# Altium schematic sheet ESP32-HWE-Dev.SchDoc
size A4; SheetNumber: 3; SheetTotal: 4
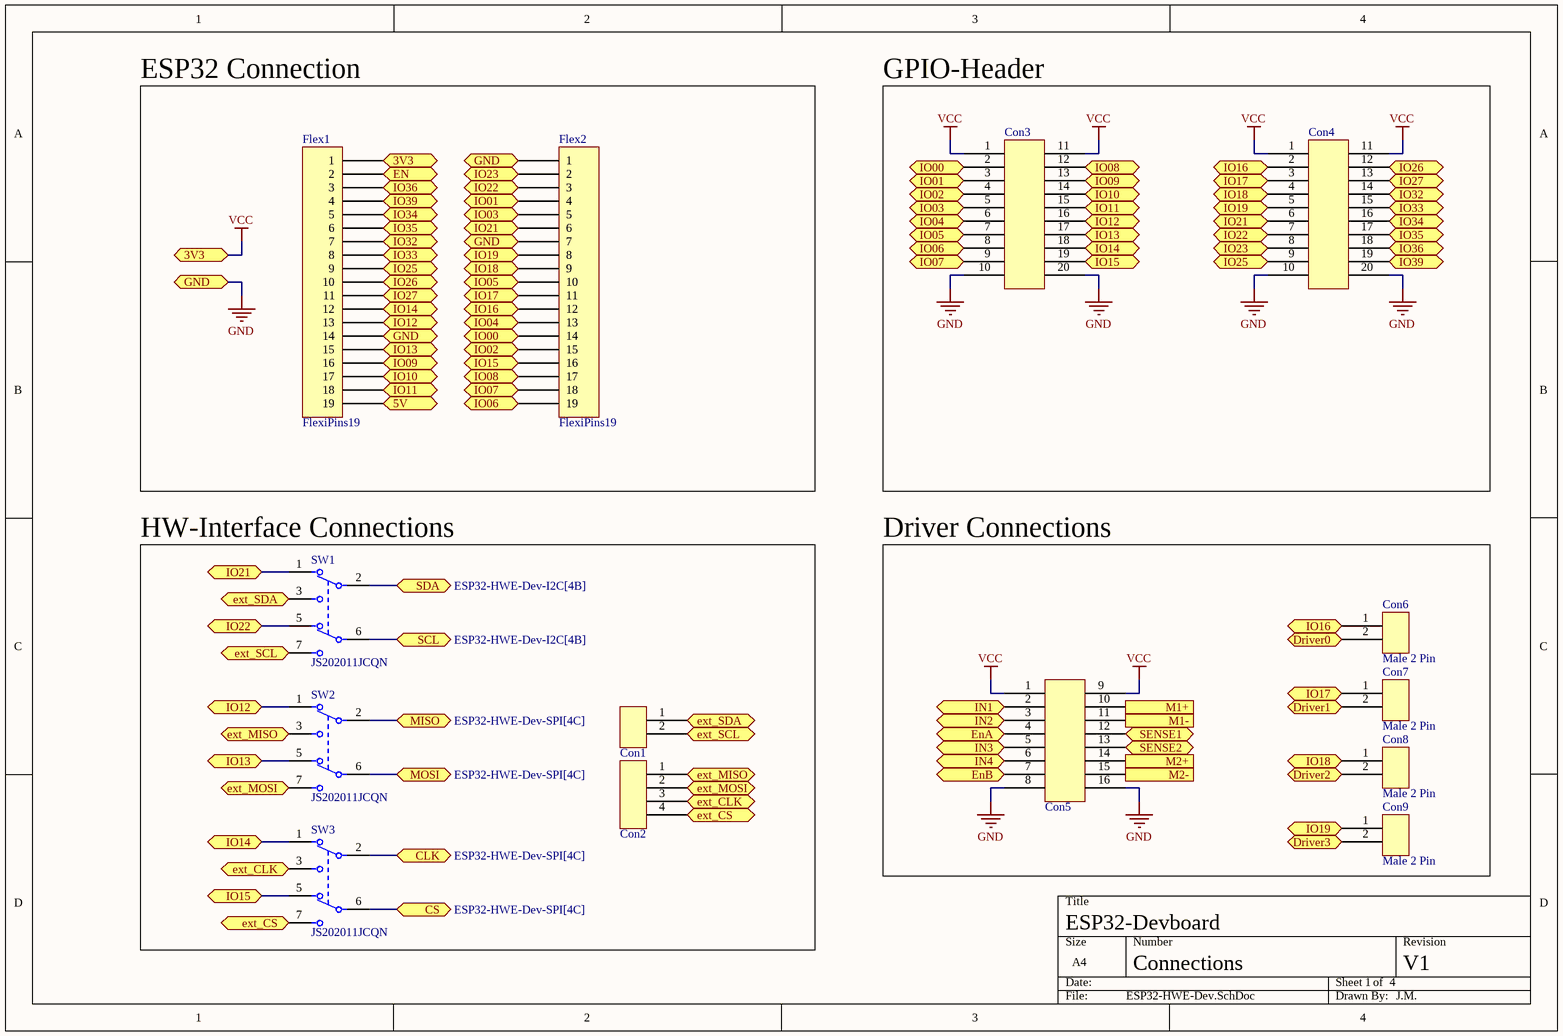
[diagram p0: ESP32-HWE-Dev.SchDoc]

## Parts
Con1  Female 2 Pin  [Header_Female_2Pin]  (value not drawn)
Con2  Female 4 Pin  [Header_Female_4Pin]  (value not drawn)
Con3  Female 2x10 Pin  [Header_Female_2x10Pin]  (value not drawn)
Con4  Female 2x10 Pin  [Header_Female_2x10Pin]  (value not drawn)
Con5  Female 2x8 Pin  [Header_Female_2x8Pin]  (value not drawn)
Con6  Male 2 Pin  [Header_Male_2Pin]
Con7  Male 2 Pin  [Header_Male_2Pin]
Con8  Male 2 Pin  [Header_Male_2Pin]
Con9  Male 2 Pin  [Header_Male_2Pin]
Flex1  FlexiPins19  [FlexiPins19]
Flex2  FlexiPins19  [FlexiPins19]
SW1  JS202011JCQN  [FP-JS202011JCQN-MFG]
SW2  JS202011JCQN  [FP-JS202011JCQN-MFG]
SW3  JS202011JCQN  [FP-JS202011JCQN-MFG]

## Blocks framed on the sheet
ESP32 Connection: Flex1 Flex2
GPIO-Header: Con3 Con4
HW-Interface Connections: Con1 Con2 SW1-SW3
Driver Connections: Con5-Con9

## Ports
3V3 (bidir, see ESP32-HWE-Dev[1A]), 5V (bidir), CLK (bidir, see ESP32-HWE-Dev-SPI[4C]), CS (bidir, see ESP32-HWE-Dev-SPI[4C]), Driver0 (bidir, see ESP32-HWE-Dev-Power[2B]), Driver1 (bidir, see ESP32-HWE-Dev-Power[3B]), Driver2 (bidir, see ESP32-HWE-Dev-Power[2C]), Driver3 (bidir, see ESP32-HWE-Dev-Power[3C]), EN (bidir), EnA (bidir, see ESP32-HWE-Dev-Power[1C]), EnB (bidir, see ESP32-HWE-Dev-Power[1C]), ext_CLK (bidir, see ESP32-HWE-Dev[1D]), ext_CLK (bidir, see ESP32-HWE-Dev[2D]), ext_CS (bidir, see ESP32-HWE-Dev[1D]), ext_CS (bidir, see ESP32-HWE-Dev[2D]), ext_MISO (bidir, see ESP32-HWE-Dev[1C]), ext_MISO (bidir, see ESP32-HWE-Dev[2D]), ext_MOSI (bidir, see ESP32-HWE-Dev[1D]), ext_MOSI (bidir, see ESP32-HWE-Dev[2D]), ext_SCL (bidir, see ESP32-HWE-Dev[1C]), ext_SCL (bidir, see ESP32-HWE-Dev[2C]), ext_SDA (bidir, see ESP32-HWE-Dev[1C]), ext_SDA (bidir, see ESP32-HWE-Dev[2C]), GND (bidir, see ESP32-HWE-Dev[1B], ESP32-HWE-Dev[2A]), IN1 (bidir, see ESP32-HWE-Dev-Power[1C]), IN2 (bidir, see ESP32-HWE-Dev-Power[1C]), IN3 (bidir, see ESP32-HWE-Dev-Power[1C]), IN4 (bidir, see ESP32-HWE-Dev-Power[1C]), IO00 (bidir, see ESP32-HWE-Dev[2B]), IO00 (bidir, see ESP32-HWE-Dev[3A]), IO01 (bidir, see ESP32-HWE-Dev[2A]), IO01 (bidir, see ESP32-HWE-Dev[3A]), IO02 (bidir, see ESP32-HWE-Dev[2B]), IO02 (bidir, see ESP32-HWE-Dev[3A]), IO03 (bidir, see ESP32-HWE-Dev[2A]), IO03 (bidir, see ESP32-HWE-Dev[3A]), IO04 (bidir, see ESP32-HWE-Dev[2B]), IO04 (bidir, see ESP32-HWE-Dev[3A]), IO05 (bidir, see ESP32-HWE-Dev[2B]), IO05 (bidir, see ESP32-HWE-Dev[3A]), IO06 (bidir, see ESP32-HWE-Dev[2B]), IO06 (bidir, see ESP32-HWE-Dev[3A]), IO07 (bidir, see ESP32-HWE-Dev[2B]), IO07 (bidir, see ESP32-HWE-Dev[3B]), IO08 (bidir, see ESP32-HWE-Dev[2B]), IO08 (bidir, see ESP32-HWE-Dev[3A]), IO09 (bidir, see ESP32-HWE-Dev[1B]), IO09 (bidir, see ESP32-HWE-Dev[3A]), IO10 (bidir, see ESP32-HWE-Dev[1B]), IO10 (bidir, see ESP32-HWE-Dev[3A]), IO11 (bidir, see ESP32-HWE-Dev[1B]), IO11 (bidir, see ESP32-HWE-Dev[3A]), IO12 (bidir, see ESP32-HWE-Dev[1B], ESP32-HWE-Dev[1C]), IO12 (bidir, see ESP32-HWE-Dev[1B], ESP32-HWE-Dev[3A]), IO12 (bidir, see ESP32-HWE-Dev[1C], ESP32-HWE-Dev[3A]), IO13 (bidir, see ESP32-HWE-Dev[1B], ESP32-HWE-Dev[1C]), IO13 (bidir, see ESP32-HWE-Dev[1B], ESP32-HWE-Dev[3A]), IO13 (bidir, see ESP32-HWE-Dev[1C], ESP32-HWE-Dev[3A]), IO14 (bidir, see ESP32-HWE-Dev[1B], ESP32-HWE-Dev[1D]), IO14 (bidir, see ESP32-HWE-Dev[1B], ESP32-HWE-Dev[3A]), IO14 (bidir, see ESP32-HWE-Dev[1D], ESP32-HWE-Dev[3A]), IO15 (bidir, see ESP32-HWE-Dev[1D], ESP32-HWE-Dev[2B]), IO15 (bidir, see ESP32-HWE-Dev[1D], ESP32-HWE-Dev[3B]), IO15 (bidir, see ESP32-HWE-Dev[2B], ESP32-HWE-Dev[3B]), IO16 (bidir, see ESP32-HWE-Dev[2B], ESP32-HWE-Dev[4A]), IO16 (bidir, see ESP32-HWE-Dev[2B], ESP32-HWE-Dev[4C]), IO16 (bidir, see ESP32-HWE-Dev[4A], ESP32-HWE-Dev[4C]), IO17 (bidir, see ESP32-HWE-Dev[2B], ESP32-HWE-Dev[4A]), IO17 (bidir, see ESP32-HWE-Dev[2B], ESP32-HWE-Dev[4C]), IO17 (bidir, see ESP32-HWE-Dev[4A], ESP32-HWE-Dev[4C]), IO18 (bidir, see ESP32-HWE-Dev[2B], ESP32-HWE-Dev[4A]), IO18 (bidir, see ESP32-HWE-Dev[2B], ESP32-HWE-Dev[4C]), IO18 (bidir, see ESP32-HWE-Dev[4A], ESP32-HWE-Dev[4C]), IO19 (bidir, see ESP32-HWE-Dev[2A], ESP32-HWE-Dev[4A]), IO19 (bidir, see ESP32-HWE-Dev[2A], ESP32-HWE-Dev[4D]), IO19 (bidir, see ESP32-HWE-Dev[4A], ESP32-HWE-Dev[4D]), IO21 (bidir, see ESP32-HWE-Dev[1C], ESP32-HWE-Dev[2A]), IO21 (bidir, see ESP32-HWE-Dev[1C], ESP32-HWE-Dev[4A]), IO21 (bidir, see ESP32-HWE-Dev[2A], ESP32-HWE-Dev[4A]), IO22 (bidir, see ESP32-HWE-Dev[1C], ESP32-HWE-Dev[2A]), IO22 (bidir, see ESP32-HWE-Dev[1C], ESP32-HWE-Dev[4A]), IO22 (bidir, see ESP32-HWE-Dev[2A], ESP32-HWE-Dev[4A]), IO23 (bidir, see ESP32-HWE-Dev[2A]), IO23 (bidir, see ESP32-HWE-Dev[4A]), IO25 (bidir, see ESP32-HWE-Dev[1B]), IO25 (bidir, see ESP32-HWE-Dev[4B]), IO26 (bidir, see ESP32-HWE-Dev[1B]), IO26 (bidir, see ESP32-HWE-Dev[4A]), IO27 (bidir, see ESP32-HWE-Dev[1B]), IO27 (bidir, see ESP32-HWE-Dev[4A]), IO32 (bidir, see ESP32-HWE-Dev[1A]), IO32 (bidir, see ESP32-HWE-Dev[4A]), IO33 (bidir, see ESP32-HWE-Dev[1A]), IO33 (bidir, see ESP32-HWE-Dev[4A]), IO34 (bidir, see ESP32-HWE-Dev[1A]), IO34 (bidir, see ESP32-HWE-Dev[4A]), IO35 (bidir, see ESP32-HWE-Dev[1A]), IO35 (bidir, see ESP32-HWE-Dev[4A]), IO36 (bidir, see ESP32-HWE-Dev[1A]), IO36 (bidir, see ESP32-HWE-Dev[4A]), IO39 (bidir, see ESP32-HWE-Dev[1A]), IO39 (bidir, see ESP32-HWE-Dev[4B]), M1+ (in, see ESP32-HWE-Dev-Power[2C]), M1- (in, see ESP32-HWE-Dev-Power[2C]), M2+ (in, see ESP32-HWE-Dev-Power[2C]), M2- (in, see ESP32-HWE-Dev-Power[2C]), MISO (bidir, see ESP32-HWE-Dev-SPI[4C]), MOSI (bidir, see ESP32-HWE-Dev-SPI[4C]), SCL (bidir, see ESP32-HWE-Dev-I2C[4B]), SDA (bidir, see ESP32-HWE-Dev-I2C[4B]), SENSE1 (bidir, see ESP32-HWE-Dev-Power[2C]), SENSE2 (bidir, see ESP32-HWE-Dev-Power[2C])

## Nets
GND: Con3.10 Con3.20 Con4.10 Con4.20 Con5.8 Con5.16 Flex1.14 Flex2.1 Flex2.7 ; port GND
VCC: Con3.1 Con3.11 Con4.1 Con4.11 Con5.1 Con5.9 Flex1.1 ; port 3V3
5V: Flex1.19 ; port 5V
CLK: SW3.2(1_C) ; port CLK
CS: SW3.6(2_C) ; port CS
Driver0: Con6.2 ; port Driver0
Driver1: Con7.2 ; port Driver1
Driver2: Con8.2 ; port Driver2
Driver3: Con9.2 ; port Driver3
EN: Flex1.2 ; port EN
EnA: Con5.4 ; port EnA
EnB: Con5.7 ; port EnB
ext_CLK: Con2.3 SW3.3 ; port ext_CLK
ext_CS: Con2.4 SW3.7 ; port ext_CS
ext_MISO: Con2.1 SW2.3 ; port ext_MISO
ext_MOSI: Con2.2 SW2.7 ; port ext_MOSI
ext_SCL: Con1.2 SW1.7 ; port ext_SCL
ext_SDA: Con1.1 SW1.3 ; port ext_SDA
IN1: Con5.2 ; port IN1
IN2: Con5.3 ; port IN2
IN3: Con5.5 ; port IN3
IN4: Con5.6 ; port IN4
IO00: Con3.2 Flex2.14 ; port IO00
IO01: Con3.3 Flex2.4 ; port IO01
IO02: Con3.4 Flex2.15 ; port IO02
IO03: Con3.5 Flex2.5 ; port IO03
IO04: Con3.6 Flex2.13 ; port IO04
IO05: Con3.7 Flex2.10 ; port IO05
IO06: Con3.8 Flex2.19 ; port IO06
IO07: Con3.9 Flex2.18 ; port IO07
IO08: Con3.12 Flex2.17 ; port IO08
IO09: Con3.13 Flex1.16 ; port IO09
IO10: Con3.14 Flex1.17 ; port IO10
IO11: Con3.15 Flex1.18 ; port IO11
IO12: Con3.16 Flex1.13 SW2.1 ; port IO12
IO13: Con3.17 Flex1.15 SW2.5 ; port IO13
IO14: Con3.18 Flex1.12 SW3.1 ; port IO14
IO15: Con3.19 Flex2.16 SW3.5 ; port IO15
IO16: Con4.2 Con6.1 Flex2.12 ; port IO16
IO17: Con4.3 Con7.1 Flex2.11 ; port IO17
IO18: Con4.4 Con8.1 Flex2.9 ; port IO18
IO19: Con4.5 Con9.1 Flex2.8 ; port IO19
IO21: Con4.6 Flex2.6 SW1.1 ; port IO21
IO22: Con4.7 Flex2.3 SW1.5 ; port IO22
IO23: Con4.8 Flex2.2 ; port IO23
IO25: Con4.9 Flex1.9 ; port IO25
IO26: Con4.12 Flex1.10 ; port IO26
IO27: Con4.13 Flex1.11 ; port IO27
IO32: Con4.14 Flex1.7 ; port IO32
IO33: Con4.15 Flex1.8 ; port IO33
IO34: Con4.16 Flex1.5 ; port IO34
IO35: Con4.17 Flex1.6 ; port IO35
IO36: Con4.18 Flex1.3 ; port IO36
IO39: Con4.19 Flex1.4 ; port IO39
M1+: Con5.10 ; port M1+
M1-: Con5.11 ; port M1-
M2+: Con5.14 ; port M2+
M2-: Con5.15 ; port M2-
MISO: SW2.2(1_C) ; port MISO
MOSI: SW2.6(2_C) ; port MOSI
SCL: SW1.6(2_C) ; port SCL
SDA: SW1.2(1_C) ; port SDA
SENSE1: Con5.12 ; port SENSE1
SENSE2: Con5.13 ; port SENSE2

## Notes on the sheet
- ESP32-Devboard
- Connections
- 1
- 4
- V1
- J.M.

## Library data of the parts
Con1 = Header_Female_2Pin
Con2 = Header_Female_4Pin
Con3 Con4 = Header_Female_2x10Pin
Con5 = Header_Female_2x8Pin
Con6-Con9 = Header_Male_2Pin
SW1-SW3 = CMP-10038-000009-1: SWITCH SLIDE DPDT 300MA 6V; Actuator Material: Nylon; Actuator Length: 2mm; Actuator Type: Standard; Electrical Life: 5000Cycles; Switch Function: On-On; Mount: Surface Mount; Current Rating: 300mA; Contact Material: Copper Alloy; Voltage Rating (DC): 6V; Throw Configuration: DPDT; Packaging: Cut Tape; Contact Plating: Silver; Min Operating Temperature: -40°C; Switch Travel: 2mm; Max Operating Temperature: 85°C